# EAGLE design ruler3 (EAGLE 9.0.0)
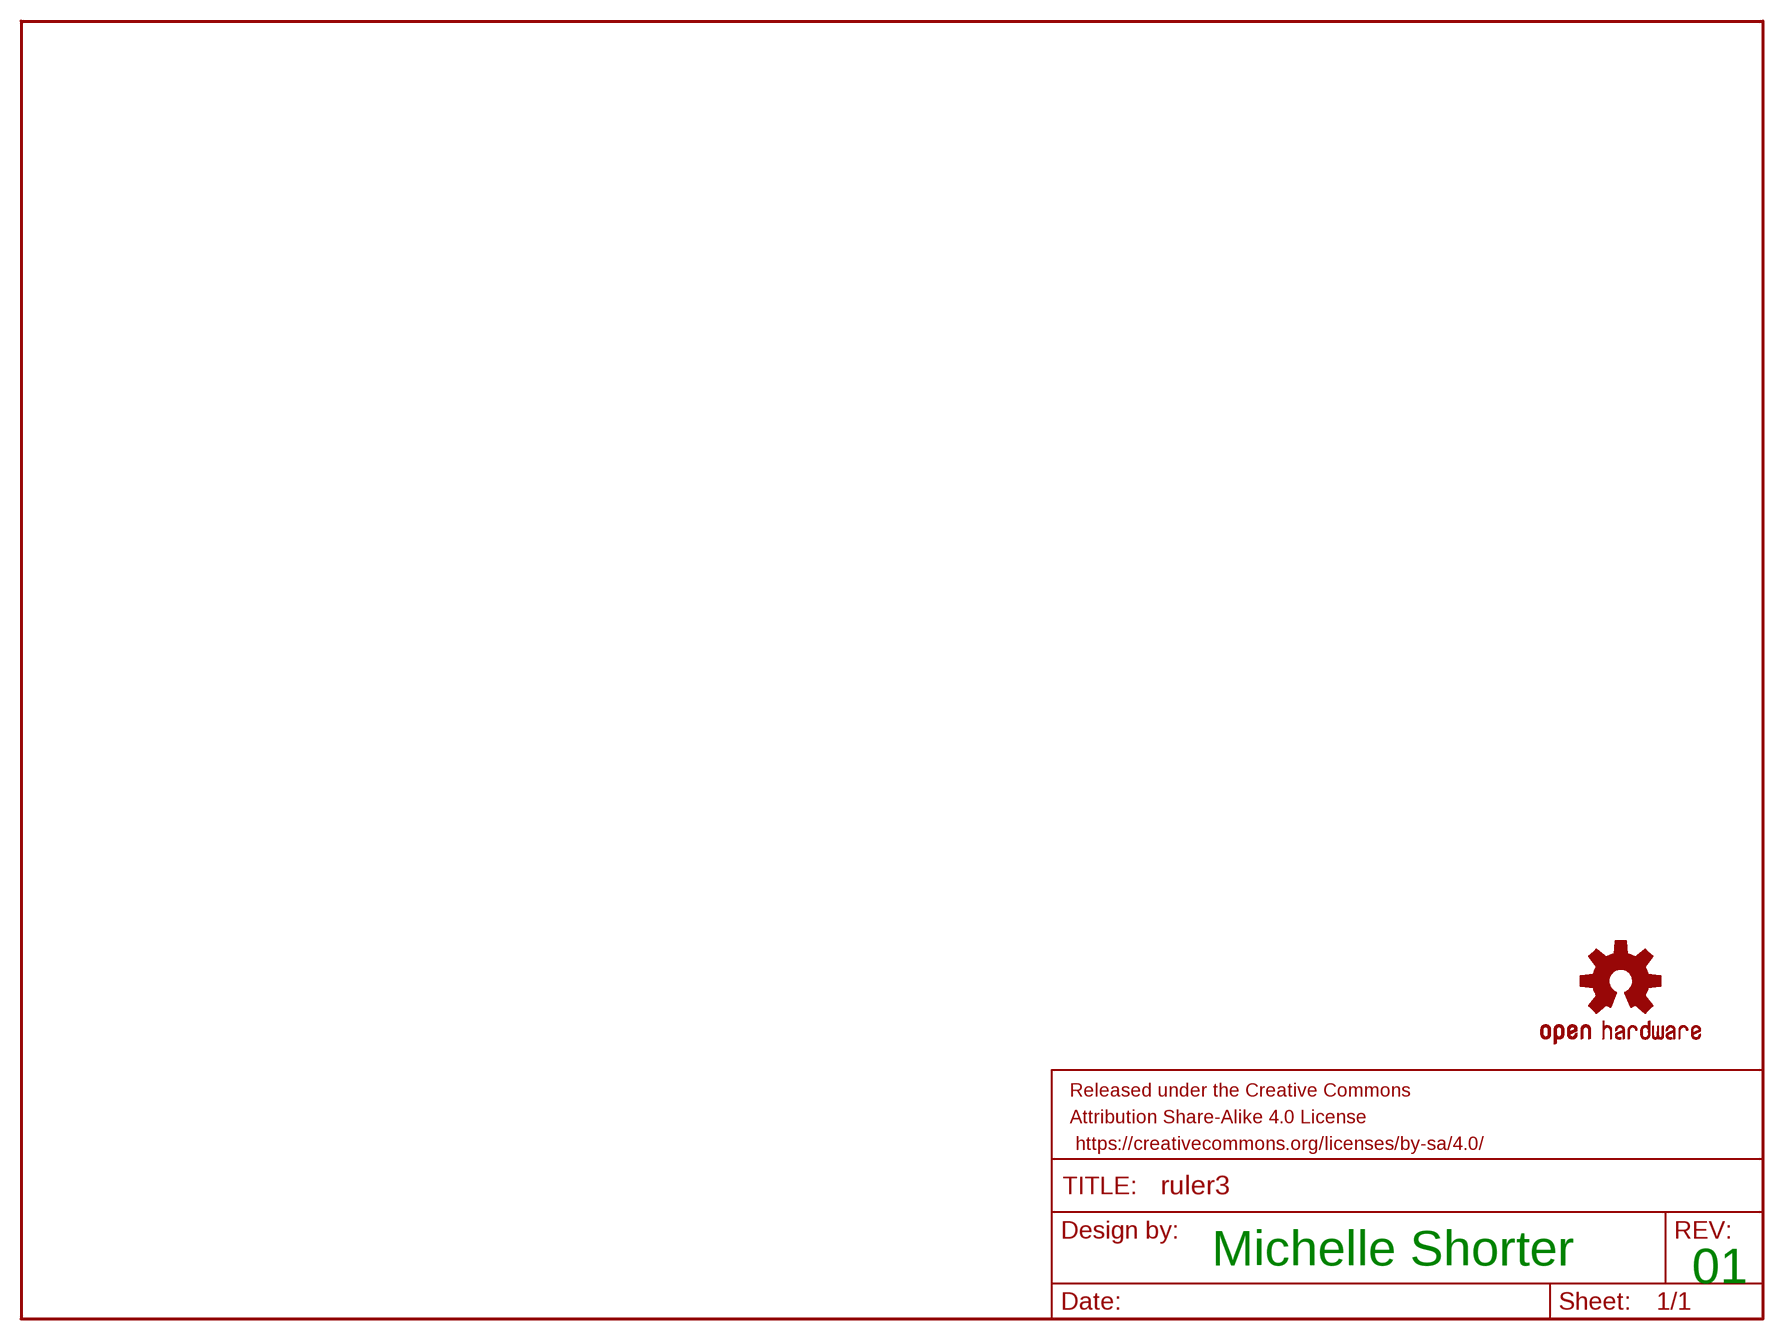
[diagram p0: schematic, sheet 1]

## Parts
FRAME1  FRAME-LETTER  [CREATIVE_COMMONS]
LOGO1  OSHW-LOGOM  [OSHW-LOGO-M]

## Notes on the sheet
- Michelle Shorter
- 01

## Library data of the parts
FRAME1 = SparkFun-Aesthetics:FRAME-LETTER: Schematic Frame - Letter Standard 8.5x11 US Letter frame
LOGO1 = SparkFun-Aesthetics:OSHW-LOGO: Open-Source Hardware (OSHW) Logo This logo indicates the piece of hardware it is found on incorporates a OSHW license and/or adheres to the definition of open source hardware found here: http://freedomdefined.org/OSHW

## Board
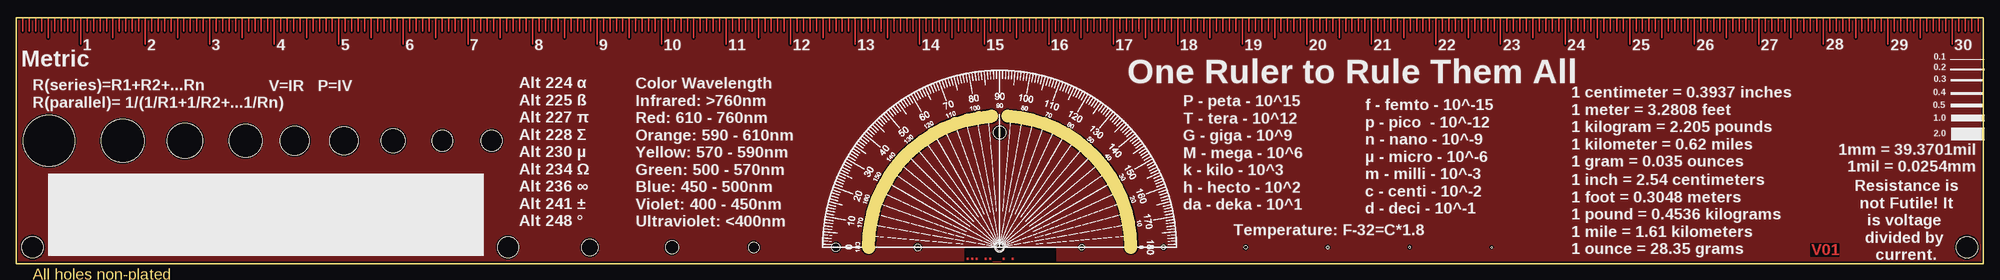
[diagram p1: board, top side]
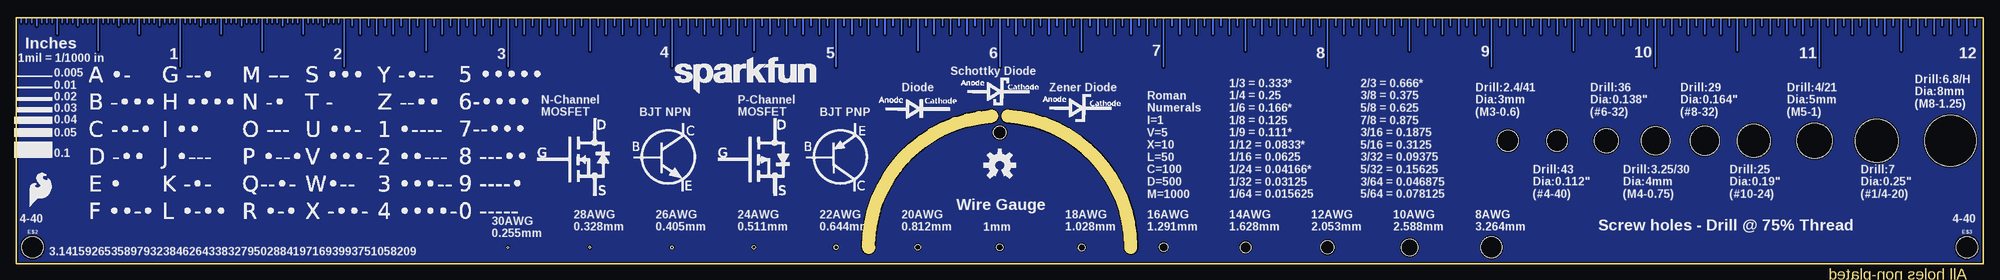
[diagram p2: board, bottom side, seen from below]

Size 304.8 x 38.1 mm. Coordinates in mm from the lower left corner, seen from the top.
Outline: 132.08,2.54 arc-86 151.13,22.86
Outline: 172.72,2.54 arc86 153.67,22.86
Outline: 304.8,0 0,0 0,38.1 304.8,38.1 304.8,0
Copper layers (1*16): Top 0.035mm / dielectric 1.5mm / Bottom 0.035mm
Design rules "SparkFun-2-layer": minimum track width 7mil, minimum drill 15mil, track to track 8mil, track to pad 8mil, pad to pad 8mil, via to via 8mil, smd to smd 8mil, copper to edge 8mil, drill to drill 8mil, minimum pad ring 12mil, minimum via ring 10mil, stop-mask expansion 4mil, vias tented up to drill 20mil, thermal gap 10mil
Holes 0.26 mm at 228.6,2.54
Holes 0.32 mm at 215.9,2.54
Holes 0.41 mm at 203.2,2.54
Holes 0.51 mm at 190.5,2.54
Holes 0.64 mm at 177.8,2.54
Holes 0.81 mm at 165.1,2.54
Holes 1 mm at 152.4,2.54
Holes 1.02 mm at 139.7,2.54
Holes 1.29 mm at 127,2.54
Holes 1.63 mm at 114.3,2.54
Holes 2.05 mm at 101.6,2.54
Holes 2.59 mm at 88.9,2.54
Holes 3.26 mm at 76.2,2.54 66.04,19.05
Holes 2 mm at 152.4,20.32
Holes 6.76 mm at 16.51,19.05
Holes 3.8 mm at 58.42,19.05
Holes 4.5 mm at 43.18,19.05
Holes 5.11 mm at 35.56,19.05
Holes 8 mm at 5.08,19.05
Holes 5.5 mm at 26.16,19.05
Holes 4.4 mm at 50.8,19.05
Holes 3.3 mm at 73.66,19.05

### Footprints (pad centres in the part's own frame; a part is rotated, then mirrored left to right if it is on the bottom)
STAND-OFF = hole 3.302: 0,0

### Placement (x,y rotation side)
E$2  [STAND-OFF]  302.26,2.54 0 bottom
E$3  [STAND-OFF]  2.54,2.54 0 bottom
FRAME1  114.3,-8.89 0 top  (outside the outline)
LOGO1  152.4,15.24 0 bottom
U$1  [BJT_NPN#PNG]  204.47,16.51 0 bottom
U$2  [BJT_PNP#PNG]  177.8,16.51 0 bottom
U$3  [DIODE#PNG]  165.1,24.13 0 bottom
U$4  [NCHANNELMOSFET#PNG]  218.44,16.51 0 bottom
U$5  [PCHANNELMOSFET#PNG]  190.5,16.51 0 bottom
U$6  [SCHOTTKYDIODE#PNG]  152.4,26.67 0 bottom
U$7  [ZENER#PNG]  139.7,24.13 0 bottom
U$9  [SFE_LOGO_NAME_.2]  191.77,29.21 0 bottom
U$11  [SFE_LOGO_FLAME_.2]  300.99,11.43 0 bottom
U$12  [PROTRACTOR#JPG]  152.37,15.71 0 top
U$13  [MORSE#PNG]  258.57,18.8 0 bottom

### Tracks (layer width: path | path; a pad name or v marks a point on that pad's centre or on a via)
N$1
  Top 0.254: 10,38 10,34
N$2
  Top 0.254: 1,38 1,36
N$3
  Top 0.254: 2,38 2,36
N$4
  Top 0.254: 3,38 3,36
N$5
  Top 0.254: 4,38 4,36
N$6
  Top 0.254: 5,38 5,35
N$7
  Top 0.254: 6,38 6,36
N$8
  Top 0.254: 7,38 7,36
N$9
  Top 0.254: 8,38 8,36
N$10
  Bottom 0.254: 1.27,38.1 1.27,36.83
N$11
  Bottom 0.254: 3.81,38.1 3.81,36.83
N$12
  Bottom 0.254: 6.35,38.1 6.35,36.83
N$13
  Bottom 0.254: 8.89,38.1 8.89,36.83
N$14
  Bottom 0.254: 11.43,38.1 11.43,36.83
N$15
  Bottom 0.254: 13.97,38.1 13.97,36.83
N$16
  Bottom 0.254: 16.51,38.1 16.51,36.83
N$17
  Bottom 0.254: 19.05,38.1 19.05,36.83
N$18
  Bottom 0.254: 21.59,38.1 21.59,36.83
N$19
  Bottom 0.254: 24.13,38.1 24.13,36.83
N$20
  Bottom 0.254: 26.67,38.1 26.67,36.83
N$21
  Bottom 0.254: 29.21,38.1 29.21,36.83
N$22
  Bottom 0.254: 31.75,38.1 31.75,36.83
N$23
  Bottom 0.254: 34.29,38.1 34.29,36.83
N$24
  Bottom 0.254: 36.83,38.1 36.83,36.83
N$25
  Bottom 0.254: 39.37,38.1 39.37,36.83
N$26
  Bottom 0.254: 41.91,38.1 41.91,36.83
N$27
  Bottom 0.254: 44.45,38.1 44.45,36.83
N$28
  Bottom 0.254: 46.99,38.1 46.99,36.83
N$29
  Bottom 0.254: 49.53,38.1 49.53,36.83
N$30
  Bottom 0.254: 52.07,38.1 52.07,36.83
N$31
  Bottom 0.254: 54.61,38.1 54.61,36.83
N$32
  Bottom 0.254: 57.15,38.1 57.15,36.83
N$33
  Bottom 0.254: 59.69,38.1 59.69,36.83
N$34
  Bottom 0.254: 62.23,38.1 62.23,36.83
N$35
  Bottom 0.254: 64.77,38.1 64.77,36.83
N$36
  Bottom 0.254: 67.31,38.1 67.31,36.83
N$37
  Bottom 0.254: 69.85,38.1 69.85,36.83
N$38
  Bottom 0.254: 72.39,38.1 72.39,36.83
N$39
  Bottom 0.254: 74.93,38.1 74.93,36.83
N$40
  Bottom 0.254: 77.47,38.1 77.47,36.83
N$41
  Bottom 0.254: 80.01,38.1 80.01,36.83
N$42
  Bottom 0.254: 82.55,38.1 82.55,36.83
N$43
  Bottom 0.254: 85.09,38.1 85.09,36.83
N$44
  Bottom 0.254: 87.63,38.1 87.63,36.83
N$45
  Bottom 0.254: 90.17,38.1 90.17,36.83
N$46
  Bottom 0.254: 92.71,38.1 92.71,36.83
N$47
  Bottom 0.254: 95.25,38.1 95.25,36.83
N$48
  Bottom 0.254: 97.79,38.1 97.79,36.83
N$49
  Bottom 0.254: 100.33,38.1 100.33,36.83
N$50
  Bottom 0.254: 102.87,38.1 102.87,36.83
N$51
  Bottom 0.254: 105.41,38.1 105.41,36.83
N$52
  Bottom 0.254: 107.95,38.1 107.95,36.83
N$53
  Bottom 0.254: 110.49,38.1 110.49,36.83
N$54
  Bottom 0.254: 113.03,38.1 113.03,36.83
N$55
  Bottom 0.254: 115.57,38.1 115.57,36.83
N$56
  Bottom 0.254: 118.11,38.1 118.11,36.83
N$57
  Bottom 0.254: 120.65,38.1 120.65,36.83
N$58
  Bottom 0.254: 123.19,38.1 123.19,36.83
N$59
  Bottom 0.254: 125.73,38.1 125.73,36.83
N$60
  Bottom 0.254: 128.27,38.1 128.27,36.83
N$61
  Bottom 0.254: 130.81,38.1 130.81,36.83
N$62
  Bottom 0.254: 133.35,38.1 133.35,36.83
N$63
  Bottom 0.254: 135.89,38.1 135.89,36.83
N$64
  Bottom 0.254: 138.43,38.1 138.43,36.83
N$65
  Bottom 0.254: 140.97,38.1 140.97,36.83
N$66
  Bottom 0.254: 143.51,38.1 143.51,36.83
N$67
  Bottom 0.254: 146.05,38.1 146.05,36.83
N$68
  Bottom 0.254: 148.59,38.1 148.59,36.83
N$69
  Bottom 0.254: 151.13,38.1 151.13,36.83
N$70
  Bottom 0.254: 153.67,38.1 153.67,36.83
N$71
  Bottom 0.254: 156.21,38.1 156.21,36.83
N$72
  Bottom 0.254: 158.75,38.1 158.75,36.83
N$73
  Bottom 0.254: 161.29,38.1 161.29,36.83
N$74
  Bottom 0.254: 163.83,38.1 163.83,36.83
N$75
  Bottom 0.254: 166.37,38.1 166.37,36.83
N$76
  Bottom 0.254: 168.91,38.1 168.91,36.83
N$77
  Bottom 0.254: 171.45,38.1 171.45,36.83
N$78
  Bottom 0.254: 173.99,38.1 173.99,36.83
N$79
  Bottom 0.254: 176.53,38.1 176.53,36.83
N$80
  Bottom 0.254: 179.07,38.1 179.07,36.83
N$81
  Bottom 0.254: 181.61,38.1 181.61,36.83
N$82
  Bottom 0.254: 184.15,38.1 184.15,36.83
N$83
  Bottom 0.254: 186.69,38.1 186.69,36.83
N$84
  Bottom 0.254: 189.23,38.1 189.23,36.83
N$85
  Bottom 0.254: 191.77,38.1 191.77,36.83
N$86
  Bottom 0.254: 194.31,38.1 194.31,36.83
N$87
  Bottom 0.254: 196.85,38.1 196.85,36.83
N$88
  Bottom 0.254: 199.39,38.1 199.39,36.83
N$89
  Bottom 0.254: 201.93,38.1 201.93,36.83
N$90
  Bottom 0.254: 204.47,38.1 204.47,36.83
N$91
  Bottom 0.254: 207.01,38.1 207.01,36.83
N$92
  Bottom 0.254: 209.55,38.1 209.55,36.83
N$93
  Bottom 0.254: 212.09,38.1 212.09,36.83
N$94
  Bottom 0.254: 214.63,38.1 214.63,36.83
N$95
  Bottom 0.254: 217.17,38.1 217.17,36.83
N$96
  Bottom 0.254: 219.71,38.1 219.71,36.83
N$97
  Bottom 0.254: 222.25,38.1 222.25,36.83
N$98
  Bottom 0.254: 224.79,38.1 224.79,36.83
N$99
  Bottom 0.254: 227.33,38.1 227.33,36.83
N$100
  Bottom 0.254: 260.35,38.1 260.35,35.56
N$101
  Bottom 0.254: 257.18,38.1 257.18,36.83
N$102
  Bottom 0.254: 263.52,38.1 263.52,36.83
N$103
  Bottom 0.254: 229.87,38.1 229.87,36.83
N$104
  Bottom 0.254: 232.41,38.1 232.41,36.83
N$105
  Bottom 0.254: 234.95,38.1 234.95,36.83
N$106
  Bottom 0.254: 237.49,38.1 237.49,36.83
N$107
  Bottom 0.254: 240.03,38.1 240.03,36.83
N$108
  Bottom 0.254: 242.57,38.1 242.57,36.83
N$109
  Bottom 0.254: 245.11,38.1 245.11,36.83
N$110
  Bottom 0.254: 247.65,38.1 247.65,36.83
N$111
  Bottom 0.254: 250.19,38.1 250.19,36.83
N$112
  Bottom 0.254: 252.73,38.1 252.73,36.83
N$113
  Top 0.254: 9,38 9,36
N$114
  Top 0.254: 11,38 11,36
N$115
  Top 0.254: 12,38 12,36
N$116
  Top 0.254: 13,38 13,36
N$117
  Top 0.254: 14,38 14,36
N$118
  Top 0.254: 15,38 15,35
N$119
  Top 0.254: 16,38 16,36
N$120
  Top 0.254: 17,38 17,36
N$121
  Top 0.254: 18,38 18,36
N$122
  Top 0.254: 19,38 19,36
N$123
  Top 0.254: 20,38 20,34
N$124
  Top 0.254: 21,38 21,36
N$125
  Top 0.254: 22,38 22,36
N$126
  Top 0.254: 23,38 23,36
N$127
  Top 0.254: 24,38 24,36
N$128
  Top 0.254: 25,38 25,35
N$129
  Top 0.254: 26,38 26,36
N$130
  Top 0.254: 27,38 27,36
N$131
  Top 0.254: 28,38 28,36
N$132
  Top 0.254: 29,38 29,36
N$133
  Top 0.254: 30,38 30,34
N$134
  Top 0.254: 31,38 31,36
N$135
  Top 0.254: 32,38 32,36
N$136
  Top 0.254: 33,38 33,36
N$137
  Top 0.254: 34,38 34,36
N$138
  Top 0.254: 35,38 35,35
N$139
  Top 0.254: 36,38 36,36
N$140
  Top 0.254: 37,38 37,36
N$141
  Top 0.254: 38,38 38,36
N$142
  Top 0.254: 39,38 39,36
N$143
  Top 0.254: 40,38 40,34
N$144
  Top 0.254: 41,38 41,36
N$145
  Top 0.254: 42,38 42,36
N$146
  Top 0.254: 43,38 43,36
N$147
  Top 0.254: 44,38 44,36
N$148
  Top 0.254: 45,38 45,35
N$149
  Top 0.254: 46,38 46,36
N$150
  Top 0.254: 47,38 47,36
N$151
  Top 0.254: 48,38 48,36
N$152
  Top 0.254: 49,38 49,36
N$153
  Top 0.254: 50,38 50,34
N$154
  Top 0.254: 51,38 51,36
N$155
  Top 0.254: 52,38 52,36
N$156
  Top 0.254: 53,38 53,36
N$157
  Top 0.254: 54,38 54,36
N$158
  Top 0.254: 55,38 55,35
N$159
  Top 0.254: 56,38 56,36
N$160
  Top 0.254: 57,38 57,36
N$161
  Top 0.254: 58,38 58,36
N$162
  Top 0.254: 59,38 59,36
N$163
  Top 0.254: 60,38 60,34
N$164
  Top 0.254: 61,38 61,36
N$165
  Top 0.254: 62,38 62,36
N$166
  Top 0.254: 63,38 63,36
N$167
  Top 0.254: 64,38 64,36
N$168
  Top 0.254: 65,38 65,35
N$169
  Top 0.254: 66,38 66,36
N$170
  Top 0.254: 67,38 67,36
N$171
  Top 0.254: 68,38 68,36
N$172
  Top 0.254: 69,38 69,36
N$173
  Top 0.254: 70,38 70,34
N$174
  Top 0.254: 71,38 71,36
N$175
  Top 0.254: 72,38 72,36
N$176
  Top 0.254: 73,38 73,36
N$177
  Top 0.254: 74,38 74,36
N$178
  Top 0.254: 75,38 75,35
N$179
  Top 0.254: 76,38 76,36
N$180
  Top 0.254: 77,38 77,36
N$181
  Top 0.254: 78,38 78,36
N$182
  Top 0.254: 79,38 79,36
N$183
  Top 0.254: 80,38 80,34
N$184
  Top 0.254: 81,38 81,36
N$185
  Top 0.254: 82,38 82,36
N$186
  Top 0.254: 83,38 83,36
N$187
  Top 0.254: 85,38 85,35
N$188
  Top 0.254: 84,38 84,36
N$189
  Top 0.254: 86,38 86,36
N$190
  Top 0.254: 87,38 87,36
N$191
  Top 0.254: 88,38 88,36
N$192
  Top 0.254: 89,38 89,36
N$193
  Top 0.254: 90,38 90,34
N$194
  Top 0.254: 91,38 91,36
N$195
  Top 0.254: 92,38 92,36
N$196
  Top 0.254: 93,38 93,36
N$197
  Top 0.254: 94,38 94,36
N$198
  Top 0.254: 95,38 95,35
N$199
  Top 0.254: 96,38 96,36
N$200
  Top 0.254: 97,38 97,36
N$201
  Top 0.254: 98,38 98,36
N$202
  Top 0.254: 99,38 99,36
N$203
  Top 0.254: 100,38 100,34
N$204
  Top 0.254: 101,38 101,36
N$205
  Top 0.254: 102,38 102,36
N$206
  Top 0.254: 103,38 103,36
N$207
  Top 0.254: 104,38 104,36
N$208
  Top 0.254: 105,38 105,35
N$209
  Top 0.254: 106,38 106,36
N$210
  Top 0.254: 107,38 107,36
N$211
  Top 0.254: 108,38 108,36
N$212
  Top 0.254: 109,38 109,36
N$213
  Top 0.254: 110,38 110,34
N$214
  Top 0.254: 111,38 111,36
N$215
  Top 0.254: 112,38 112,36
N$216
  Top 0.254: 113,38 113,36
N$217
  Top 0.254: 114,38 114,36
N$218
  Top 0.254: 115,38 115,35
N$219
  Top 0.254: 116,38 116,36
N$220
  Top 0.254: 117,38 117,36
N$221
  Top 0.254: 118,38 118,36
N$222
  Top 0.254: 119,38 119,36
N$223
  Top 0.254: 120,38 120,34
N$224
  Top 0.254: 121,38 121,36
N$225
  Top 0.254: 122,38 122,36
N$226
  Top 0.254: 123,38 123,36
N$227
  Top 0.254: 124,38 124,36
N$228
  Top 0.254: 125,38 125,35
N$229
  Top 0.254: 126,38 126,36
N$230
  Top 0.254: 127,38 127,36
N$231
  Top 0.254: 128,38 128,36
N$232
  Top 0.254: 129,38 129,36
N$233
  Top 0.254: 130,38 130,34
N$234
  Top 0.254: 131,38 131,36
N$235
  Top 0.254: 132,38 132,36
N$236
  Top 0.254: 133,38 133,36
N$237
  Top 0.254: 134,38 134,36
N$238
  Top 0.254: 135,38 135,35
N$239
  Top 0.254: 136,38 136,36
N$240
  Top 0.254: 137,38 137,36
N$241
  Top 0.254: 138,38 138,36
N$242
  Top 0.254: 139,38 139,36
N$243
  Top 0.254: 140,38 140,34
N$244
  Top 0.254: 141,38 141,36
N$245
  Top 0.254: 142,38 142,36
N$246
  Top 0.254: 143,38 143,36
N$247
  Top 0.254: 144,38 144,36
N$248
  Top 0.254: 145,38 145,35
N$249
  Top 0.254: 146,38 146,36
N$250
  Top 0.254: 147,38 147,36
N$251
  Top 0.254: 148,38 148,36
N$252
  Top 0.254: 149,38 149,36
N$253
  Top 0.254: 150,38 150,34
N$254
  Top 0.254: 151,38 151,36
N$255
  Top 0.254: 152,38 152,36
N$256
  Top 0.254: 153,38 153,36
N$257
  Top 0.254: 154,38 154,36
N$258
  Top 0.254: 155,38 155,35
N$259
  Top 0.254: 156,38 156,36
N$260
  Top 0.254: 157,38 157,36
N$261
  Top 0.254: 158,38 158,36
N$262
  Top 0.254: 159,38 159,36
N$263
  Top 0.254: 160,38 160,34
N$264
  Top 0.254: 161,38 161,36
N$265
  Top 0.254: 162,38 162,36
N$266
  Top 0.254: 163,38 163,36
N$267
  Top 0.254: 164,38 164,36
N$268
  Top 0.254: 165,38 165,35
N$269
  Top 0.254: 166,38 166,36
N$270
  Top 0.254: 167,38 167,36
N$271
  Top 0.254: 168,38 168,36
N$272
  Top 0.254: 169,38 169,36
N$273
  Top 0.254: 170,38 170,34
N$274
  Top 0.254: 171,38 171,36
N$275
  Top 0.254: 172,38 172,36
N$276
  Top 0.254: 173,38 173,36
N$277
  Top 0.254: 174,38 174,36
N$278
  Top 0.254: 175,38 175,35
N$279
  Top 0.254: 176,38 176,36
N$280
  Top 0.254: 177,38 177,36
N$281
  Top 0.254: 178,38 178,36
N$282
  Top 0.254: 179,38 179,36
N$283
  Top 0.254: 180,38 180,34
N$284
  Top 0.254: 181,38 181,36
N$285
  Top 0.254: 182,38 182,36
N$286
  Top 0.254: 183,38 183,36
N$287
  Top 0.254: 184,38 184,36
N$288
  Top 0.254: 185,38 185,35
N$289
  Top 0.254: 186,38 186,36
N$290
  Top 0.254: 187,38 187,36
N$291
  Top 0.254: 188,38 188,36
N$292
  Top 0.254: 189,38 189,36
N$293
  Top 0.254: 190,38 190,34
N$294
  Top 0.254: 191,38 191,36
N$295
  Top 0.254: 192,38 192,36
N$296
  Top 0.254: 193,38 193,36
N$297
  Top 0.254: 194,38 194,36
N$298
  Top 0.254: 195,38 195,35
N$299
  Top 0.254: 196,38 196,36
N$300
  Top 0.254: 197,38 197,36
N$301
  Top 0.254: 198,38 198,36
N$302
  Top 0.254: 199,38 199,36
N$303
  Top 0.254: 200,38 200,34
N$304
  Top 0.254: 201,38 201,36
N$305
  Top 0.254: 202,38 202,36
N$306
  Top 0.254: 203,38 203,36
N$307
  Top 0.254: 204,38 204,36
N$308
  Top 0.254: 205,38 205,35
N$309
  Top 0.254: 206,38 206,36
N$310
  Top 0.254: 207,38 207,36
N$311
  Top 0.254: 208,38 208,36
N$312
  Top 0.254: 209,38 209,36
N$313
  Top 0.254: 210,38 210,34
N$314
  Top 0.254: 211,38 211,36
N$315
  Top 0.254: 212,38 212,36
N$316
  Top 0.254: 213,38 213,36
N$317
  Top 0.254: 214,38 214,36
N$318
  Top 0.254: 215,38 215,35
N$319
  Top 0.254: 216,38 216,36
N$320
  Top 0.254: 217,38 217,36
N$321
  Top 0.254: 218,38 218,36
N$322
  Top 0.254: 219,38 219,36
N$323
  Top 0.254: 220,38 220,34
N$324
  Top 0.254: 221,38 221,36
N$325
  Top 0.254: 222,38 222,36
N$326
  Top 0.254: 223,38 223,36
N$327
  Top 0.254: 224,38 224,36
N$328
  Top 0.254: 225,38 225,35
N$329
  Top 0.254: 226,38 226,36
N$330
  Top 0.254: 227,38 227,36
N$331
  Top 0.254: 228,38 228,36
N$332
  Top 0.254: 229,38 229,36
N$333
  Top 0.254: 230,38 230,34
N$334
  Top 0.254: 231,38 231,36
N$335
  Top 0.254: 232,38 232,36
N$336
  Top 0.254: 233,38 233,36
N$337
  Top 0.254: 234,38 234,36
N$338
  Top 0.254: 235,38 235,35
N$339
  Top 0.254: 236,38 236,36
N$340
  Top 0.254: 237,38 237,36
N$341
  Top 0.254: 238,38 238,36
N$342
  Top 0.254: 239,38 239,36
N$343
  Top 0.254: 240,38 240,34
N$344
  Top 0.254: 241,38 241,36
N$345
  Top 0.254: 242,38 242,36
N$346
  Top 0.254: 243,38 243,36
N$347
  Top 0.254: 244,38 244,36
N$348
  Top 0.254: 245,38 245,35
N$349
  Top 0.254: 246,38 246,36
N$350
  Top 0.254: 247,38 247,36
N$351
  Top 0.254: 248,38 248,36
N$352
  Top 0.254: 249,38 249,36
N$353
  Top 0.254: 250,38 250,34
N$354
  Top 0.254: 251,38 251,36
N$355
  Top 0.254: 252,38 252,36
N$356
  Top 0.254: 253,38 253,36
N$357
  Top 0.254: 254,38 254,36
N$358
  Top 0.254: 255,38 255,35
N$359
  Top 0.254: 256,38 256,36
N$360
  Top 0.254: 257,38 257,36
N$361
  Top 0.254: 258,38 258,36
N$362
  Top 0.254: 259,38 259,36
N$363
  Top 0.254: 260,38 260,34
N$364
  Top 0.254: 261,38 261,36
N$365
  Top 0.254: 262,38 262,36
N$366
  Top 0.254: 263,38 263,36
N$367
  Top 0.254: 264,38 264,36
N$368
  Top 0.254: 265,38 265,35
N$369
  Top 0.254: 266,38 266,36
N$370
  Top 0.254: 267,38 267,36
N$371
  Top 0.254: 268,38 268,36
N$372
  Top 0.254: 269,38 269,36
N$373
  Top 0.254: 270,38 270,34
N$374
  Top 0.254: 271,38 271,36
N$375
  Top 0.254: 272,38 272,36
N$376
  Top 0.254: 273,38 273,36
N$377
  Top 0.254: 274,38 274,36
N$378
  Top 0.254: 275,38 275,35
N$379
  Top 0.254: 276,38 276,36
N$380
  Top 0.254: 277,38 277,36
N$381
  Top 0.254: 278,38 278,36
N$382
  Top 0.254: 279,38 279,36
N$383
  Top 0.254: 280,38 280,34
N$384
  Top 0.254: 281,38 281,36
N$385
  Top 0.254: 282,38 282,36
N$386
  Top 0.254: 283,38 283,36
N$387
  Top 0.254: 284,38 284,36
N$388
  Top 0.254: 285,38 285,35
N$389
  Top 0.254: 286,38 286,36
N$390
  Top 0.254: 287,38 287,36
N$391
  Top 0.254: 288,38 288,36
N$392
  Top 0.254: 289,38 289,36
N$393
  Top 0.254: 290,38 290,34
N$394
  Top 0.254: 291,38 291,36
N$395
  Top 0.254: 292,38 292,36
N$396
  Top 0.254: 293,38 293,36
N$397
  Top 0.254: 294,38 294,36
N$398
  Top 0.254: 295,38 295,35
N$399
  Top 0.254: 296,38 296,36
N$400
  Top 0.254: 297,38 297,36
N$401
  Top 0.254: 298,38 298,36
N$402
  Top 0.254: 299,38 299,36
N$403
  Top 0.254: 300,38 300,34
N$404
  Top 0.254: 301,38 301,36
N$405
  Top 0.254: 302,38 302,36
N$406
  Top 0.254: 303,38 303,36
N$407
  Top 0.254: 304,38 304,36
N$408
  Bottom 0.254: 255.59,38.1 255.59,37.31
N$409
  Bottom 0.254: 254.79,38.1 254.79,37.31
N$410
  pour Top: 0,0 0,38 305,38 305,0 304.5,0
N$411
  pour Bottom: 0,0 0,38 305,38 305,0 304.5,0
N$412
  Bottom 0.254: 256.38,38.1 256.38,37.31
N$413
  Bottom 0.254: 257.97,38.1 257.97,37.31
N$414
  Bottom 0.254: 258.76,38.1 258.76,37.31
N$415
  Bottom 0.254: 259.56,38.1 259.56,37.31
N$416
  Bottom 0.254: 261.14,38.1 261.14,37.31
N$417
  Bottom 0.254: 261.94,38.1 261.94,37.31
N$418
  Bottom 0.254: 262.73,38.1 262.73,37.31
N$419
  Bottom 0.254: 264.32,38.1 264.32,37.31
N$420
  Bottom 0.254: 265.11,38.1 265.11,37.31
N$421
  Bottom 0.254: 265.91,38.1 265.91,37.31
N$422
  Bottom 0.254: 267.49,38.1 267.49,37.31
N$423
  Bottom 0.254: 268.29,38.1 268.29,37.31
N$424
  Bottom 0.254: 269.08,38.1 269.08,37.31
N$425
  Bottom 0.254: 270.67,38.1 270.67,37.31
N$426
  Bottom 0.254: 271.46,38.1 271.46,37.31
N$427
  Bottom 0.254: 272.26,38.1 272.26,37.31
N$428
  Bottom 0.254: 273.84,38.1 273.84,37.31
N$429
  Bottom 0.254: 274.64,38.1 274.64,37.31
N$430
  Bottom 0.254: 275.43,38.1 275.43,37.31
N$431
  Bottom 0.254: 277.02,38.1 277.02,37.31
N$432
  Bottom 0.254: 277.81,38.1 277.81,37.31
N$433
  Bottom 0.254: 278.61,38.1 278.61,37.31
N$434
  Bottom 0.254: 280.19,38.1 280.19,37.31
N$435
  Bottom 0.254: 280.99,38.1 280.99,37.31
N$436
  Bottom 0.254: 281.78,38.1 281.78,37.31
N$437
  Bottom 0.254: 283.37,38.1 283.37,37.31
N$438
  Bottom 0.254: 284.16,38.1 284.16,37.31
N$439
  Bottom 0.254: 284.96,38.1 284.96,37.31
N$440
  Bottom 0.254: 286.54,38.1 286.54,37.31
N$441
  Bottom 0.254: 287.34,38.1 287.34,37.31
N$442
  Bottom 0.254: 288.13,38.1 288.13,37.31
N$443
  Bottom 0.254: 289.72,38.1 289.72,37.31
N$444
  Bottom 0.254: 290.51,38.1 290.51,37.31
N$445
  Bottom 0.254: 291.31,38.1 291.31,37.31
N$446
  Bottom 0.254: 292.89,38.1 292.89,37.31
N$447
  Bottom 0.254: 293.69,38.1 293.69,37.31
N$448
  Bottom 0.254: 294.48,38.1 294.48,37.31
N$449
  Bottom 0.254: 296.07,38.1 296.07,37.31
N$450
  Bottom 0.254: 296.86,38.1 296.86,37.31
N$451
  Bottom 0.254: 297.66,38.1 297.66,37.31
N$452
  Bottom 0.254: 299.24,38.1 299.24,37.31
N$453
  Bottom 0.254: 300.04,38.1 300.04,37.31
N$454
  Bottom 0.254: 300.83,38.1 300.83,37.31
N$455
  Bottom 0.254: 302.42,38.1 302.42,37.31
N$456
  Bottom 0.254: 303.21,38.1 303.21,37.31
N$457
  Bottom 0.254: 304.01,38.1 304.01,37.31
S$1
  Bottom 0.254: 279.4,38.1 279.4,30.48
S$2
  Bottom 0.254: 292.1,38.1 292.1,33.02
S$3
  Bottom 0.254: 298.45,38.1 298.45,35.56
S$4
  Bottom 0.254: 285.75,38.1 285.75,35.56
S$5
  Bottom 0.254: 254,38.1 254,30.48
S$6
  Bottom 0.254: 266.7,38.1 266.7,33.02
S$7
  Bottom 0.254: 228.6,38.1 228.6,30.48
S$8
  Bottom 0.254: 203.2,38.1 203.2,30.48
S$9
  Bottom 0.254: 241.3,38.1 241.3,33.02
S$10
  Bottom 0.254: 215.9,38.1 215.9,33.02
S$11
  Bottom 0.254: 190.5,38.1 190.5,33.02
S$12
  Bottom 0.254: 177.8,38.1 177.8,30.48
S$13
  Bottom 0.254: 165.1,38.1 165.1,33.02
S$14
  Bottom 0.254: 152.4,38.1 152.4,30.48
S$15
  Bottom 0.254: 139.7,38.1 139.7,33.02
S$16
  Bottom 0.254: 127,38.1 127,30.48
S$17
  Bottom 0.254: 114.3,38.1 114.3,33.02
S$18
  Bottom 0.254: 101.6,38.1 101.6,30.48
S$19
  Bottom 0.254: 88.9,38.1 88.9,33.02
S$20
  Bottom 0.254: 76.2,38.1 76.2,30.48
S$21
  Bottom 0.254: 63.5,38.1 63.5,33.02
S$22
  Bottom 0.254: 50.8,38.1 50.8,30.48
S$23
  Bottom 0.254: 38.1,38.1 38.1,33.02
S$24
  Bottom 0.254: 25.4,38.1 25.4,30.48
S$25
  Bottom 0.254: 12.7,38.1 12.7,33.02
S$26
  Bottom 0.254: 301.62,38.1 301.62,36.83
S$27
  Bottom 0.254: 295.27,38.1 295.27,36.83
S$28
  Bottom 0.254: 288.93,38.1 288.93,36.83
S$29
  Bottom 0.254: 282.57,38.1 282.57,36.83
S$33
  Bottom 0.254: 273.05,38.1 273.05,35.56
S$34
  Bottom 0.254: 276.23,38.1 276.23,36.83
S$35
  Bottom 0.254: 269.88,38.1 269.88,36.83
S$40
  Bottom 0.254: 251.46,38.1 251.46,35.56
S$41
  Bottom 0.254: 248.92,38.1 248.92,35.56
S$42
  Bottom 0.254: 246.38,38.1 246.38,35.56
S$43
  Bottom 0.254: 243.84,38.1 243.84,35.56
S$44
  Bottom 0.254: 238.76,38.1 238.76,35.56
S$45
  Bottom 0.254: 236.22,38.1 236.22,35.56
S$46
  Bottom 0.254: 233.68,38.1 233.68,35.56
S$47
  Bottom 0.254: 231.14,38.1 231.14,35.56
S$48
  Bottom 0.254: 226.06,38.1 226.06,35.56
S$49
  Bottom 0.254: 223.52,38.1 223.52,35.56
S$50
  Bottom 0.254: 220.98,38.1 220.98,35.56
S$51
  Bottom 0.254: 218.44,38.1 218.44,35.56
S$52
  Bottom 0.254: 213.36,38.1 213.36,35.56
S$53
  Bottom 0.254: 210.82,38.1 210.82,35.56
S$54
  Bottom 0.254: 208.28,38.1 208.28,35.56
S$55
  Bottom 0.254: 205.74,38.1 205.74,35.56
S$56
  Bottom 0.254: 200.66,38.1 200.66,35.56
S$57
  Bottom 0.254: 198.12,38.1 198.12,35.56
S$58
  Bottom 0.254: 195.58,38.1 195.58,35.56
S$59
  Bottom 0.254: 193.04,38.1 193.04,35.56
S$60
  Bottom 0.254: 187.96,38.1 187.96,35.56
S$61
  Bottom 0.254: 185.42,38.1 185.42,35.56
S$62
  Bottom 0.254: 182.88,38.1 182.88,35.56
S$63
  Bottom 0.254: 180.34,38.1 180.34,35.56
S$64
  Bottom 0.254: 175.26,38.1 175.26,35.56
S$65
  Bottom 0.254: 172.72,38.1 172.72,35.56
S$66
  Bottom 0.254: 170.18,38.1 170.18,35.56
S$67
  Bottom 0.254: 167.64,38.1 167.64,35.56
S$68
  Bottom 0.254: 162.56,38.1 162.56,35.56
S$69
  Bottom 0.254: 160.02,38.1 160.02,35.56
S$70
  Bottom 0.254: 157.48,38.1 157.48,35.56
S$71
  Bottom 0.254: 154.94,38.1 154.94,35.56
S$72
  Bottom 0.254: 149.86,38.1 149.86,35.56
S$73
  Bottom 0.254: 147.32,38.1 147.32,35.56
S$74
  Bottom 0.254: 144.78,38.1 144.78,35.56
S$75
  Bottom 0.254: 142.24,38.1 142.24,35.56
S$76
  Bottom 0.254: 137.16,38.1 137.16,35.56
S$77
  Bottom 0.254: 134.62,38.1 134.62,35.56
S$78
  Bottom 0.254: 132.08,38.1 132.08,35.56
S$79
  Bottom 0.254: 129.54,38.1 129.54,35.56
S$80
  Bottom 0.254: 124.46,38.1 124.46,35.56
S$81
  Bottom 0.254: 121.92,38.1 121.92,35.56
S$82
  Bottom 0.254: 119.38,38.1 119.38,35.56
S$83
  Bottom 0.254: 116.84,38.1 116.84,35.56
S$84
  Bottom 0.254: 111.76,38.1 111.76,35.56
S$85
  Bottom 0.254: 109.22,38.1 109.22,35.56
S$86
  Bottom 0.254: 106.68,38.1 106.68,35.56
S$87
  Bottom 0.254: 104.14,38.1 104.14,35.56
S$88
  Bottom 0.254: 99.06,38.1 99.06,35.56
S$89
  Bottom 0.254: 96.52,38.1 96.52,35.56
S$90
  Bottom 0.254: 93.98,38.1 93.98,35.56
S$91
  Bottom 0.254: 91.44,38.1 91.44,35.56
S$92
  Bottom 0.254: 86.36,38.1 86.36,35.56
S$93
  Bottom 0.254: 83.82,38.1 83.82,35.56
S$94
  Bottom 0.254: 81.28,38.1 81.28,35.56
S$95
  Bottom 0.254: 78.74,38.1 78.74,35.56
S$96
  Bottom 0.254: 73.66,38.1 73.66,35.56
S$97
  Bottom 0.254: 71.12,38.1 71.12,35.56
S$98
  Bottom 0.254: 68.58,38.1 68.58,35.56
S$99
  Bottom 0.254: 66.04,38.1 66.04,35.56
S$100
  Bottom 0.254: 60.96,38.1 60.96,35.56
S$101
  Bottom 0.254: 58.42,38.1 58.42,35.56
S$102
  Bottom 0.254: 55.88,38.1 55.88,35.56
S$103
  Bottom 0.254: 53.34,38.1 53.34,35.56
S$104
  Bottom 0.254: 48.26,38.1 48.26,35.56
S$105
  Bottom 0.254: 45.72,38.1 45.72,35.56
S$106
  Bottom 0.254: 43.18,38.1 43.18,35.56
S$107
  Bottom 0.254: 40.64,38.1 40.64,35.56
S$108
  Bottom 0.254: 35.56,38.1 35.56,35.56
S$109
  Bottom 0.254: 33.02,38.1 33.02,35.56
S$110
  Bottom 0.254: 30.48,38.1 30.48,35.56
S$111
  Bottom 0.254: 27.94,38.1 27.94,35.56
S$112
  Bottom 0.254: 22.86,38.1 22.86,35.56
S$113
  Bottom 0.254: 20.32,38.1 20.32,35.56
S$114
  Bottom 0.254: 17.78,38.1 17.78,35.56
S$115
  Bottom 0.254: 15.24,38.1 15.24,35.56
S$116
  Bottom 0.254: 10.16,38.1 10.16,35.56
S$117
  Bottom 0.254: 7.62,38.1 7.62,35.56
S$118
  Bottom 0.254: 5.08,38.1 5.08,35.56
S$119
  Bottom 0.254: 2.54,38.1 2.54,35.56

### Text on the board
Top: V01 | ... .._. .
Dimension: All holes non-plated
tPlace: 1 | 2 | 3 | 4 | 5 | 6 | 7 | 8 | 9 | 10 | 11 | 12 | 13 | 14 | 15 | 16 | 17 | 18 | 19 | 20 | 21 | 22 | 23 | 24 | 25 | 26 | 27 | 28 | 29 | 30 | 0.1 | Metric | 0.2 | One Ruler to Rule Them All | 0.3 | V=IR P=IV | 0.4 | R(series)=R1+R2+...Rn / R(parallel)= 1/(1/R1+1/R2+...1/Rn) | 0.5 | 1.0 | 2.0 | 1mm = 39.3701mil | 1 centimeter = 0.3937 inches / 1 meter = 3.2808 feet / 1 kilogram = 2.205 pounds / 1 kilometer = 0.62 miles / 1 gram = 0.035 ounces | 1mil = 0.0254mm | P - peta - 10^15 / T - tera - 10^12 / G - giga - 10^9 / M - mega - 10^6 / k - kilo - 10^3 / h - hecto - 10^2 / da - deka - 10^1 | f - femto - 10^-15 / p - pico - 10^-12 / n - nano - 10^-9 / µ - micro - 10^-6 / m - milli - 10^-3 / c - centi - 10^-2 / d - deci - 10^-1 | Resistance is / not Futile! It / is voltage / divided by / current. | Alt 224 α / Alt 225 ß / Alt 227 π / Alt 228 Σ / Alt 230 µ / Alt 234 Ω / Alt 236 ∞ / Alt 241 ± / Alt 248 ° | Color Wavelength / Infrared: >760nm / Red: 610 - 760nm / Orange: 590 - 610nm / Yellow: 570 - 590nm / Green: 500 - 570nm / Blue: 450 - 500nm / Violet: 400 - 450nm / Ultraviolet: <400nm | Temperature: F-32=C*1.8 | 1 inch = 2.54 centimeters / 1 foot = 0.3048 meters / 1 pound = 0.4536 kilograms / 1 mile = 1.61 kilometers / 1 ounce = 28.35 grams
bPlace: Inches | 12 | 11 | 10 | 9 | 8 | 7 | 6 | 5 | 4 | 3 | 2 | 1 | 1mil = 1/1000 in | Schottky Diode | 0.005 | Zener Diode | Diode | 0.01 | 0.02 | Drill:6.8/H / Dia:8mm / (M8-1.25) | Drill:4/21 / Dia:5mm / (M5-1) | Drill:29 / Dia:0.164" / (#8-32) | Drill:36 / Dia:0.138" / (#6-32) | Drill:2.4/41 / Dia:3mm / (M3-0.6) | BJT PNP | P-Channel / MOSFET | BJT NPN | N-Channel / MOSFET | 0.03 | 0.04 | 0.05 | 0.1 | Drill:7 / Dia:0.25" / (#1/4-20) | Drill:25 / Dia:0.19" / (#10-24) | Drill:3.25/30 / Dia:4mm / (M4-0.75) | Drill:43 / Dia:0.112" / (#4-40) | 2/3 = 0.666* / 3/8 = 0.375 / 5/8 = 0.625 / 7/8 = 0.875 / 3/16 = 0.1875 / 5/16 = 0.3125 / 3/32 = 0.09375 / 5/32 = 0.15625 / 3/64 = 0.046875 / 5/64 = 0.078125 | 1/3 = 0.333* / 1/4 = 0.25 / 1/6 = 0.166* / 1/8 = 0.125 / 1/9 = 0.111* / 1/12 = 0.0833* / 1/16 = 0.0625 / 1/24 = 0.04166* / 1/32 = 0.03125 / 1/64 = 0.015625 | Roman / Numerals / I=1 / V=5 / X=10 / L=50 / C=100 / D=500 / M=1000 | Wire Gauge | 4-40 | 4-40 | Screw holes - Drill @ 75% Thread | 8AWG / 3.264mm | 10AWG / 2.588mm | 12AWG / 2.053mm | 14AWG / 1.628mm | 16AWG / 1.291mm | 18AWG / 1.028mm | 1mm | 20AWG / 0.812mm | 22AWG / 0.644mm | 24AWG / 0.511mm | 26AWG / 0.405mm | 28AWG / 0.328mm | 30AWG / 0.255mm | 3.1415926535897932384626433832795028841971693993751058209
tDocu: Michelle Shorter